# Altium schematic sheet io2.SchDoc
size A; SheetNumber: 2; SheetTotal: 7
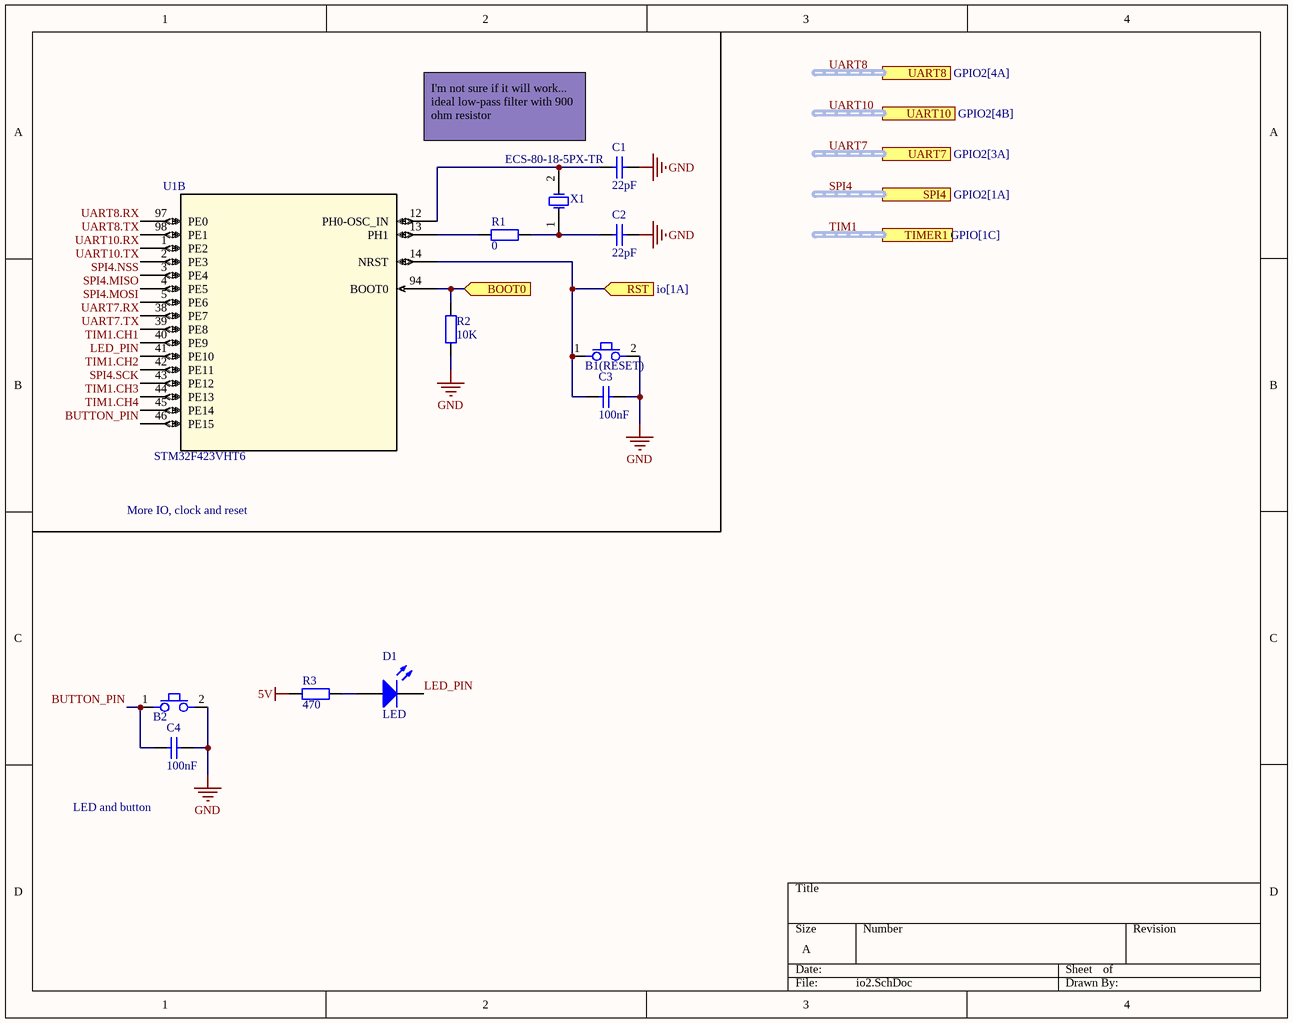
[diagram p0: io2.SchDoc]

## Parts
B1(RESET)  Button  [FP_BTN_SMD_3x6]  (value not drawn)
B2  Button  [FP_BTN_SMD_3x6]  (value not drawn)
C1  22pF  [FP_0805_CAP_085]
C2  22pF  [FP_0805_CAP_085]
C3  100nF  [FP_0805_CAP_085]
C4  100nF  [FP_0805_CAP_085]
D1  LED  [FP_0805_LED_BLUE]
R1  0  [FP_0805_RES]
R2  10K  [FP_0805_RES]
R3  470  [FP_0805_RES]
U1  STM32F423VHT6  [LQFP100-14x14mm]  (part B of 3)
X1  ECS-80-18-5PX-TR  [ECS-80-18-5PX-TR_V]

## Ports
BOOT0 (in), RST (in, see io[1A]), SPI4 (harness SPI, see GPIO2[1A]), TIMER1 (harness TIMER, see GPIO[1C]), UART7 (harness UART, see GPIO2[3A]), UART8 (harness UART, see GPIO2[4A]), UART10 (harness UART, see GPIO2[4B])

## Nets
5V: R3.1
GND: B1(RESET).2 B2.2 C1.1 C2.1 C3.2 C4.2 R2.1
BOOT0: R2.2 U1.94(BOOT0) ; port BOOT0
BUTTON_PIN: B2.1 C4.1 U1.46(PE15)
LED_PIN: D1.2(K) U1.41(PE10)
RST: B1(RESET).1 C3.1 U1.14(NRST) ; port RST
SPI4.MISO: U1.4(PE5)
SPI4.MOSI: U1.5(PE6)
SPI4.NSS: U1.3(PE4)
SPI4.SCK: U1.43(PE12)
TIM1.CH1: U1.40(PE9)
TIM1.CH2: U1.42(PE11)
TIM1.CH3: U1.44(PE13)
TIM1.CH4: U1.45(PE14)
UART7.RX: U1.38(PE7)
UART7.TX: U1.39(PE8)
UART8.RX: U1.97(PE0)
UART8.TX: U1.98(PE1)
UART10.RX: U1.1(PE2)
UART10.TX: U1.2(PE3)
NetC1_2: C1.2 U1.12(PH0-OSC_IN) X1.2(X2)
NetC2_2: C2.2 R1.2 X1.1(X1)
NetD1_1: D1.1(A) R3.2
NetR1_1: R1.1 U1.13(PH1)

## Buses and harness runs
harness SPI4 = port SPI4
harness TIM1 = port TIMER1
harness UART7 = port UART7
harness UART8 = port UART8
harness UART10 = port UART10

## Notes on the sheet
- I'm not sure if it will work...  ideal low-pass filter with 900 ohm resistor
- More IO, clock and reset
- LED and button

## Library data of the parts
B1(RESET) B2 = Button 2P: Push button
C1-C4 = CAP: Capacitor
  C1 C2: Value: 22pF
  C3 C4: Value: 100nF
D1 = LED: Typical RED GaAs LED; pin to pad: 1>A 2>K; Supplier: lomex; Verified: false
R1-R3 = RES: Resistor
  R1: Value: 0
  R2: Value: 10K
  R3: Value: 470
U1 = STM32F423VHT6: No Description Available; Mfr_Name: STMicroelectronics; RefDes: RefDes; Type: Type
X1 = CMP-2000-06193-1: Low Profile Quartz Crystal, 8.0 MHz, 2-Pin SMD, RoHS, Tape and Reel; Brand: ECS; Tolerance: 30PPM; Case Height: 4.3mm; Frequency: 8MHz; Frequency Stability: 50PPM; Case Length: 13.2mm; Case Width: 4.8mm; Load Capacitance: 18pF; Termination Style: SMD/SMT; Product Category: Crystals; Packaging: Reel; Package Reference: ECS-80-18-5PX-TR; Mounting Technology: SurfaceMount; Dimensions: 4.8mmWx13.2mmLx4.3mmH; Package Description: 2-Pin Surface Mount Device, Body 11.4 x 4.8 mm, Height 4.3 mm; Datasheet URL: https://www.ecsxtal.com/store/pdf/csm-7x.pdf; Datasheet Version: 05/2016; Manufacturer: ECS; Factory Pack Quantity: 1000; Manufacturer URL: https://www.ecsxtal.com/; Type: SMDQuartzCrystals; Mounting Style: SMD/SMT; Package / Case: HC-49/US; Operating Temperature Range: -10Cto+70C; RoHS: Details; Series: CSM-7X